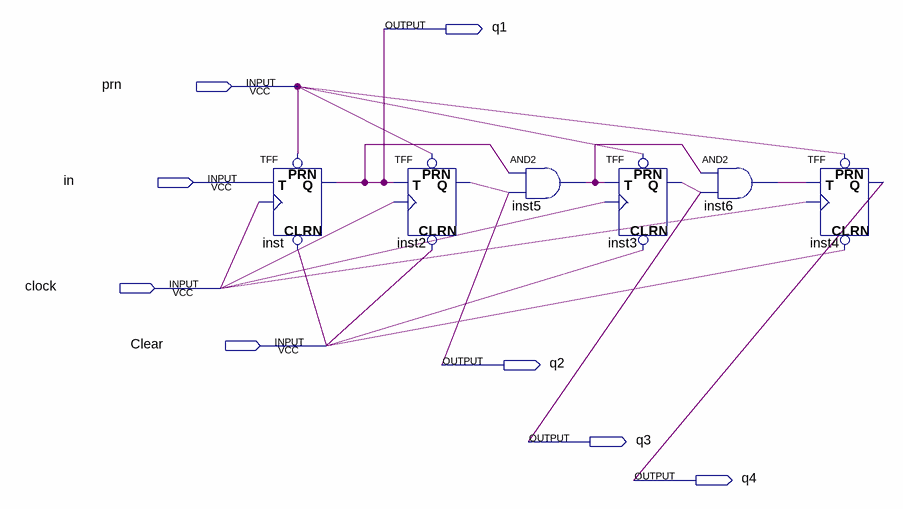
[diagram p0: schematic sheet]
// Quartus schematic question2b.bdf as structural Verilog: 6 symbols, 8 pins
module question2b (
  input  prn,
  input  in,
  input  clock,
  input  Clear,
  output q1,
  output q2,
  output q3,
  output q4
);

  wire inst5_out, inst6_out;

  TFF inst (.PRN(prn), .CLRN(Clear), .T(in), .CLK(clock), .Q(q1));
  TFF inst2 (.PRN(prn), .CLRN(Clear), .T(q1), .CLK(clock), .Q(q2));
  and inst5 (inst5_out, q1, q2);
  TFF inst3 (.PRN(prn), .CLRN(Clear), .T(inst5_out), .CLK(clock), .Q(q3));
  and inst6 (inst6_out, inst5_out, q3);
  TFF inst4 (.PRN(prn), .CLRN(Clear), .T(inst6_out), .CLK(clock), .Q(q4));
endmodule
